# Altium schematic sheet USB.SchDoc
size A4; SheetNumber: 1; SheetTotal: 1
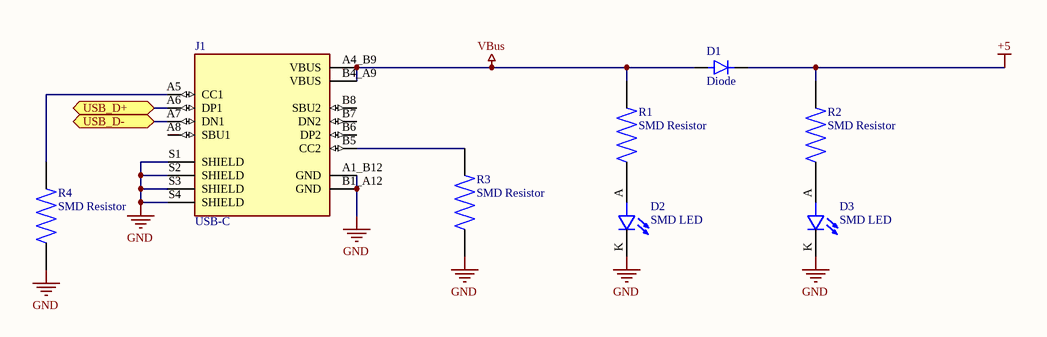
[diagram p0: USB.SchDoc]

## Parts
D1  Diode  [Diode-Footprint-1]
D2  SMD LED  [SMD LED-Footprint-1]
D3  SMD LED  [SMD LED-Footprint-1]
J1  USB-C  [USB-C-Footprint-1]
R1  SMD Resistor  [SMD Resistor-Footprint-1]
R2  SMD Resistor  [SMD Resistor-Footprint-1]
R3  SMD Resistor  [SMD Resistor-Footprint-1]
R4  SMD Resistor  [SMD Resistor-Footprint-1]

## Ports
USB_D+ (bidir), USB_D- (bidir)

## Nets
+5: D1.K R2.1
GND: D2.K(C) D3.K(C) J1.A1_B12(GND) J1.B1_A12(GND) J1.S1(SHIELD) J1.S2(SHIELD) J1.S3(SHIELD) J1.S4(SHIELD) R3.2 R4.2
VBus: D1.A J1.A4_B9(VBUS) J1.B4_A9(VBUS) R1.1
USB_D+: J1.A6(DP1) ; port USB_D+
USB_D-: J1.A7(DN1) ; port USB_D-
NetD2_A: D2.A R1.2
NetD3_A: D3.A R2.2
NetJ1_A5: J1.A5(CC1) R4.1
NetJ1_B5: J1.B5(CC2) R3.1

Not connected (* = marked no-connect by the designer): J1 A8(SBU1) B6(DP2) B7(DN2) B8(SBU2)

## Library data of the parts
D1 = CMP-00008-1: Generic Diode
D2 D3 = CMP-00018-3: Generic SMD LED
J1 = CMP-00020-5: USB-C Connector
R1-R4 = CMP-00019-2: Generic SMD Resistor